# Altium schematic sheet FPGA Connect.SchDoc
size B
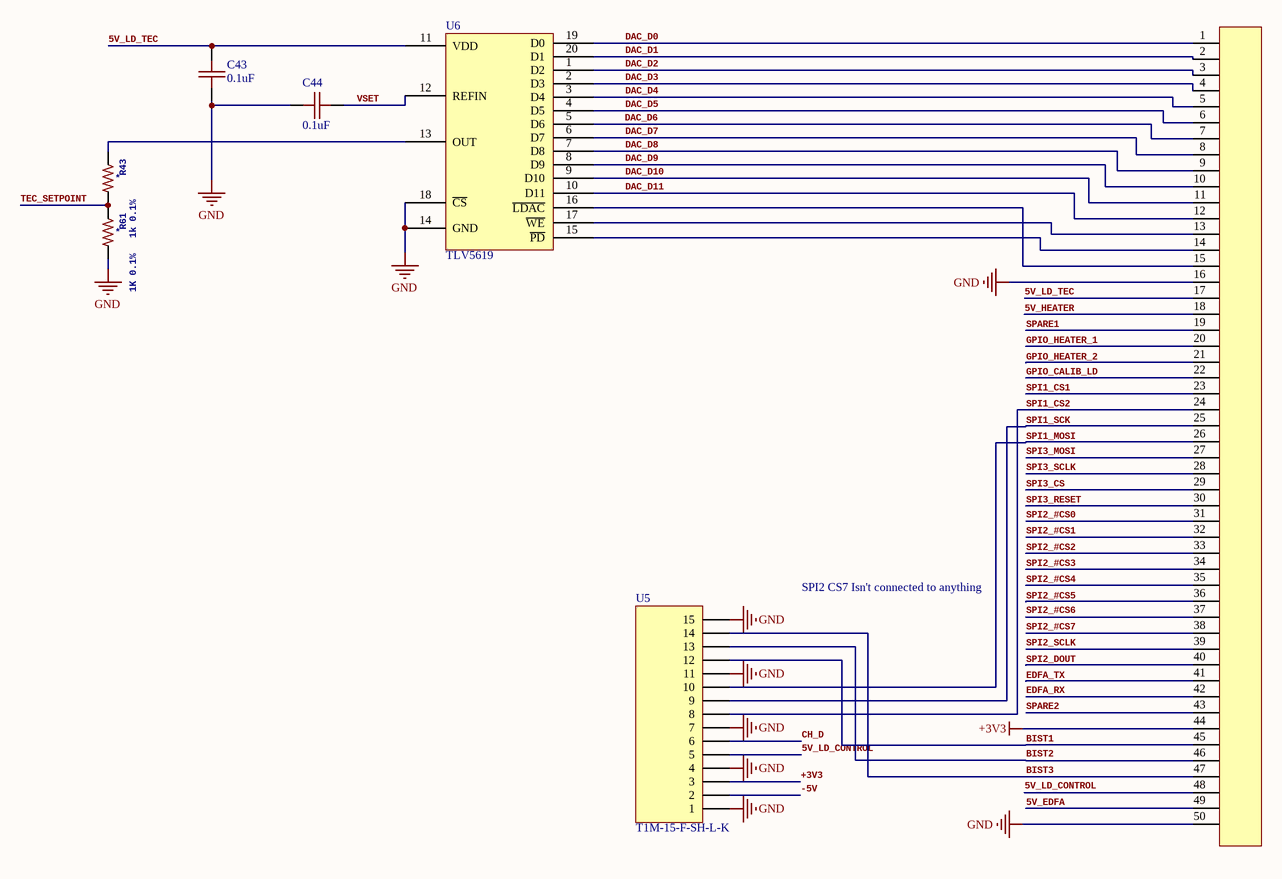
[diagram p0: FPGA Connect.SchDoc]

## Parts
C43  0.1uF  [0402 B]
C44  0.1uF  [0402 B]
CON5  (no value)  [LSEM-150-XX.X-X-DV-A-X-XX-TR]
R43  1k 0.1%  [0402R]
R61  1K 0.1%  [0402R]
U5  T1M-15-F-SH-L-K  [T1M-15-F-SH-L-K]
U6  TLV5619  [TSSOP-20]

## Nets
+3V3: CON5.44 U5.3
GND: C43.2 C44.2 CON5.16 CON5.50 R61.2 U5.1 U5.4 U5.7 U5.11 U5.15 U6.14(GND) U6.18(~{CS})
5V_EDFA: CON5.49
5V_HEATER: CON5.18
5V_LD_CONTROL: CON5.48 U5.5
5V_LD_TEC: C43.1 CON5.17 U6.11(VDD)
-5V: U5.2
BIST1: CON5.45 U5.12
BIST2: CON5.46 U5.13
BIST3: CON5.47 U5.14
CH_D: U5.6
DAC_D0: CON5.1 U6.19(D0)
DAC_D1: CON5.2 U6.20(D1)
DAC_D2: CON5.3 U6.1(D2)
DAC_D3: CON5.4 U6.2(D3)
DAC_D4: CON5.5 U6.3(D4)
DAC_D5: CON5.6 U6.4(D5)
DAC_D6: CON5.7 U6.5(D6)
DAC_D7: CON5.8 U6.6(D7)
DAC_D8: CON5.9 U6.7(D8)
DAC_D9: CON5.10 U6.8(D9)
DAC_D10: CON5.11 U6.9(D10)
DAC_D11: CON5.12 U6.10(D11)
EDFA_RX: CON5.42
EDFA_TX: CON5.41
GPIO_CALIB_LD: CON5.22
GPIO_HEATER_1: CON5.20
GPIO_HEATER_2: CON5.21
SPARE1: CON5.19
SPARE2: CON5.43
SPI1_CS1: CON5.23
SPI1_CS2: CON5.24 U5.8
SPI1_MOSI: CON5.26 U5.10
SPI1_SCK: CON5.25 U5.9
SPI2_#CS0: CON5.31
SPI2_#CS1: CON5.32
SPI2_#CS2: CON5.33
SPI2_#CS3: CON5.34
SPI2_#CS4: CON5.35
SPI2_#CS5: CON5.36
SPI2_#CS6: CON5.37
SPI2_#CS7: CON5.38
SPI2_DOUT: CON5.40
SPI2_SCLK: CON5.39
SPI3_CS: CON5.29
SPI3_MOSI: CON5.27
SPI3_RESET: CON5.30
SPI3_SCLK: CON5.28
TEC_SETPOINT: R43.2 R61.1
VSET: C44.1 U6.12(REFIN)
NetCON5_13: CON5.13 U6.17(~{WE})
NetCON5_14: CON5.14 U6.15(~{PD})
NetCON5_15: CON5.15 U6.16(~{LDAC})
NetR43_1: R43.1 U6.13(OUT)

## Notes on the sheet
- SPI2 CS7 Isn't connected to anything

## Library data of the parts
C43 C44 = CAP 0402: 402 Capacitor
CON5 = SAMTEC_LSEM_V_50: SAMTEC connector SAMTEC_LSEM_V_50
R43 R61 = R-US_R0603: RESISTOR, American symbol; GateName_1: G$1; SymbolName_1: R-US; DeviceName: R0603; DeviceSetName: R-US_; LibraryName: rcl; NAME: *